# EAGLE schematic umod4 (EAGLE 7.6.0)

## Sheet 1 of 8
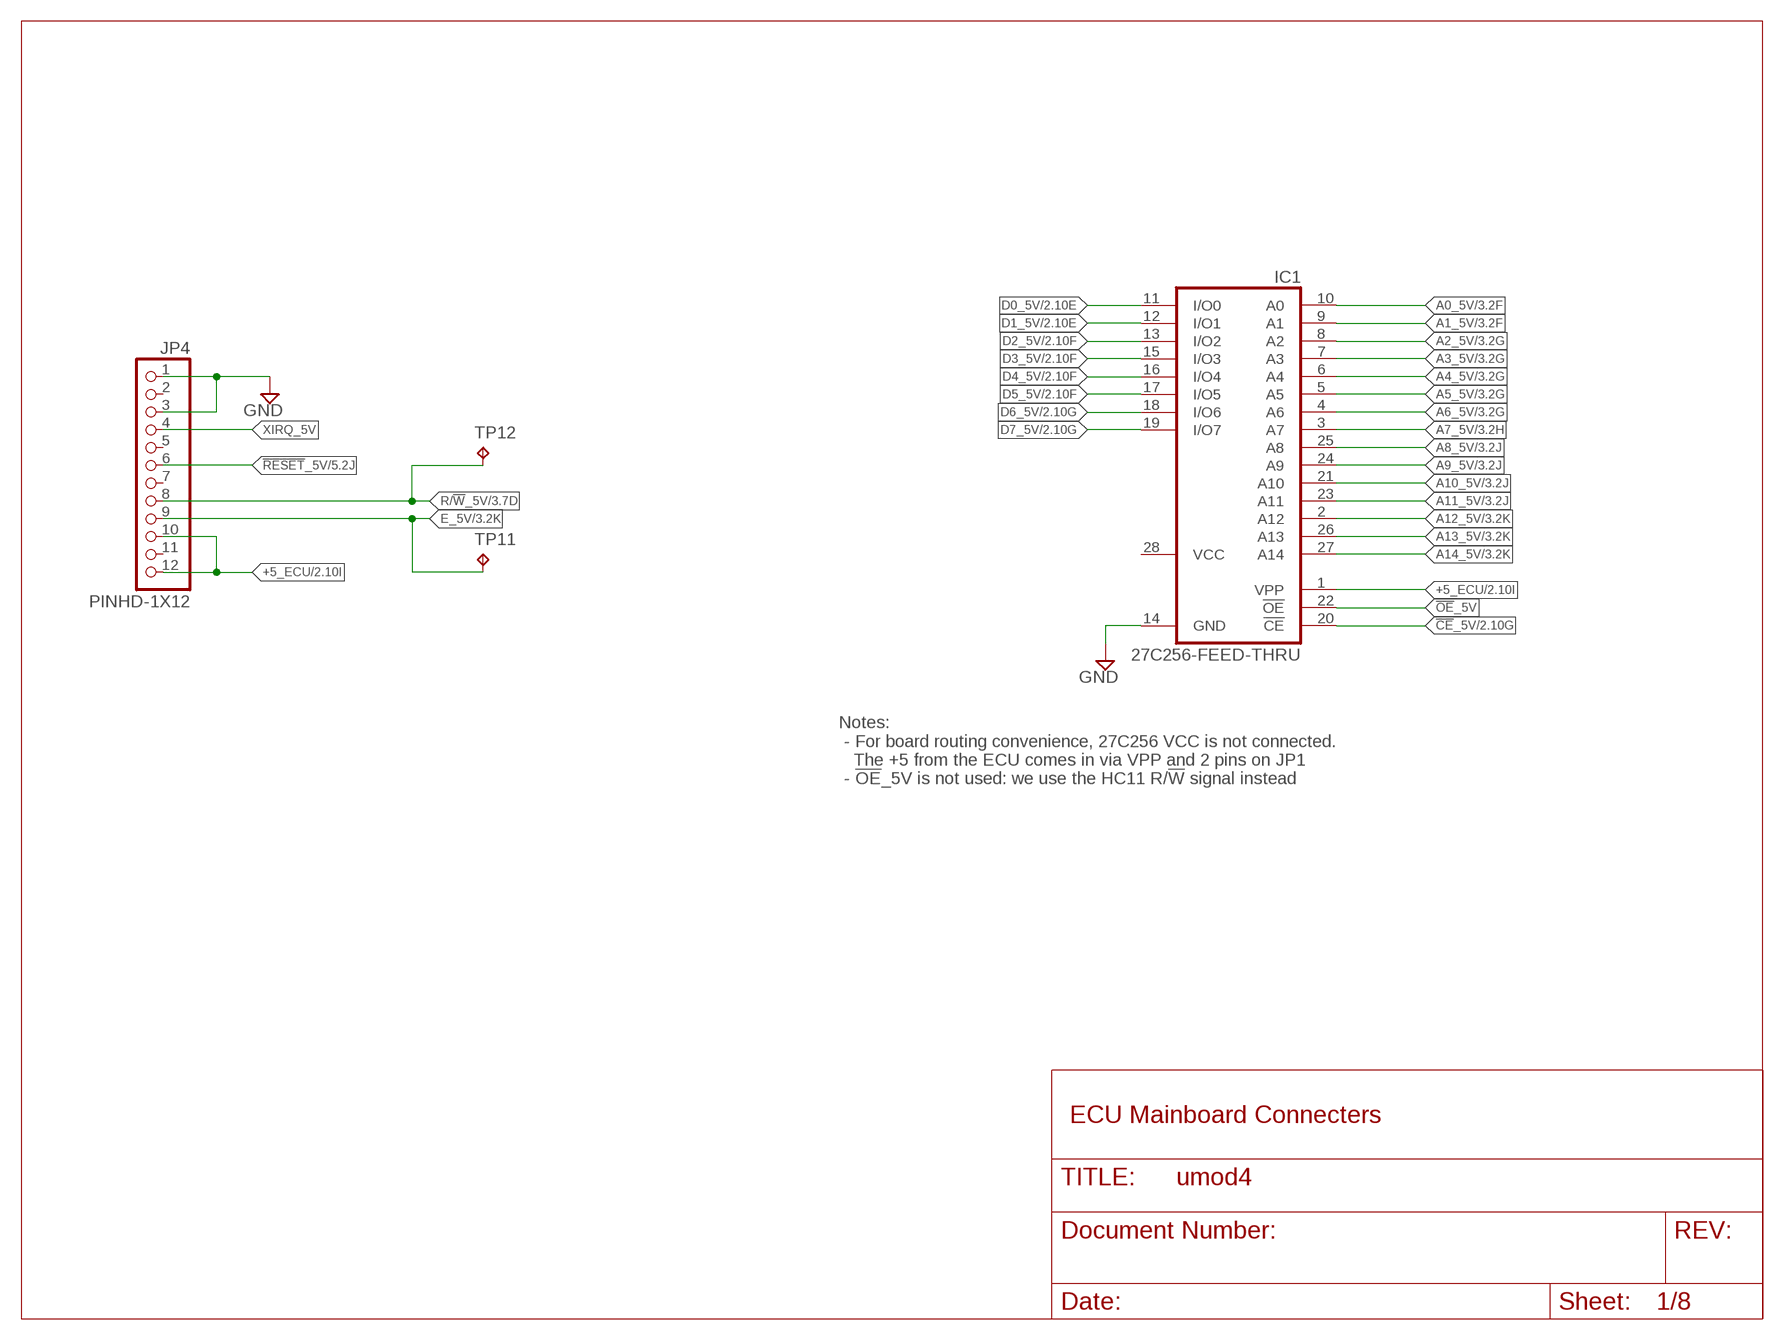
[diagram p0: schematic, sheet 1]

### Parts
IC1  27C256-FEED-THRU  27C256-FEED-THRUDIL28-6  [DIL28-6]
JP4  PINHD-1X12  [1X12]
TP11  1035  TEST-POINT-1035  [KEYSTONE-1035]
TP12  1035  TEST-POINT-1035  [KEYSTONE-1035]

### Nets
!CE!_5V: IC1.20(!CE) ; also sheet 2,3
!OE!_5V: IC1.22(!OE)
!RESET!_5V: JP4.6 ; also sheet 5
+5_ECU: IC1.1(VPP) JP4.10 JP4.12 ; also sheet 2,4
A0_5V: IC1.10(A0) ; also sheet 3
A1_5V: IC1.9(A1) ; also sheet 3
A2_5V: IC1.8(A2) ; also sheet 3
A3_5V: IC1.7(A3) ; also sheet 3
A4_5V: IC1.6(A4) ; also sheet 3
A5_5V: IC1.5(A5) ; also sheet 3
A6_5V: IC1.4(A6) ; also sheet 3
A7_5V: IC1.3(A7) ; also sheet 3
A8_5V: IC1.25(A8) ; also sheet 3
A9_5V: IC1.24(A9) ; also sheet 3
A10_5V: IC1.21(A10) ; also sheet 3
A11_5V: IC1.23(A11) ; also sheet 3
A12_5V: IC1.2(A12) ; also sheet 3
A13_5V: IC1.26(A13) ; also sheet 3
A14_5V: IC1.27(A14) ; also sheet 3
D0_5V: IC1.11(I/O0) ; also sheet 2
D1_5V: IC1.12(I/O1) ; also sheet 2
D2_5V: IC1.13(I/O2) ; also sheet 2
D3_5V: IC1.15(I/O3) ; also sheet 2
D4_5V: IC1.16(I/O4) ; also sheet 2
D5_5V: IC1.17(I/O5) ; also sheet 2
D6_5V: IC1.18(I/O6) ; also sheet 2
D7_5V: IC1.19(I/O7) ; also sheet 2
E_5V: JP4.9 TP11.P$1(TP) ; also sheet 3
GND: IC1.14(GND) JP4.1 JP4.3 ; also sheet 2,3,4,5,6,7,8
R/!W!_5V: JP4.8 TP12.P$1(TP) ; also sheet 3
XIRQ_5V: JP4.4
Unconnected: JP4.2 JP4.5 JP4.7 JP4.11

### Notes on the sheet
- Notes:
   - For board routing convenience, 27C256 VCC is not connected.
     The +5 from the ECU comes in via VPP and 2 pins on JP1
   - !OE!_5V is not used: we use the HC11 R/!W! signal instead
- ECU Mainboard Connecters

## Sheet 2 of 8
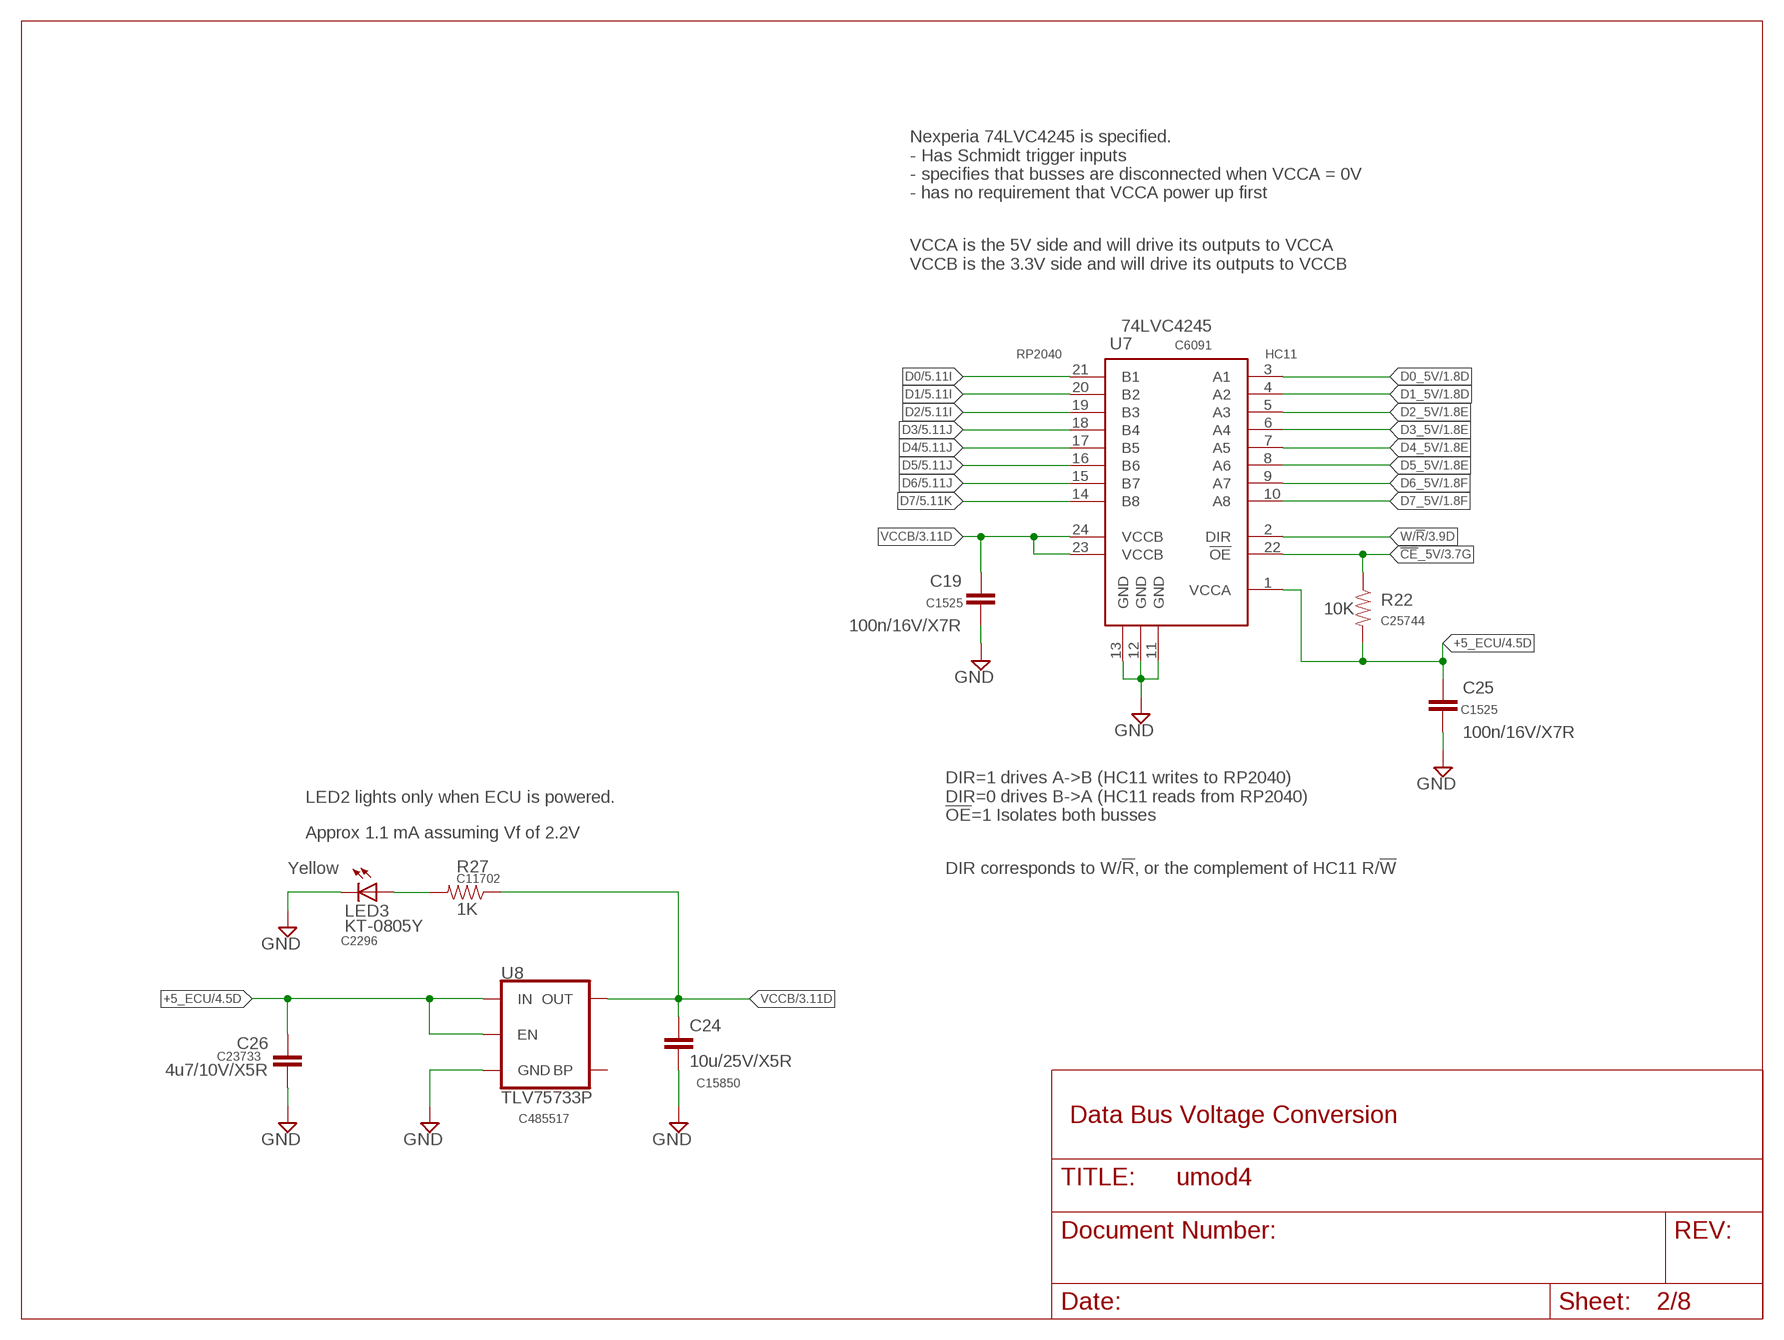
[diagram p1: schematic, sheet 2]

### Parts
C19  100n/16V/X7R  CAP0402-CAP  [0402-CAP]
C24  10u/25V/X5R  CAP-0805  [SMD-0805]
C25  100n/16V/X7R  CAP0402-CAP  [0402-CAP]
C26  4u7/10V/X5R  CAP0402-CAP  [0402-CAP]
LED3  KT-0805Y  LEDSML0805  [SML0805]
R22  10K  RESISTOR0402-RES  [0402-RES]
R27  1K  RESISTOR0402-RES  [0402-RES]
U7  74LVC4245  74LVC4245-TSSOP24  [TSSOP-24]
U8  TLV75733P  V_REG_MIC52053.3V  [SOT23-5]

### Nets
!CE!_5V: R22.1 U7.22(!OE) ; also sheet 1,3
+5_ECU: C25.1 C26.1 R22.2 U7.1(VCCA) U8.1(IN) U8.3(EN) ; also sheet 1,4
D0: U7.21(B1) ; also sheet 5
D0_5V: U7.3(A1) ; also sheet 1
D1: U7.20(B2) ; also sheet 5
D1_5V: U7.4(A2) ; also sheet 1
D2: U7.19(B3) ; also sheet 5
D2_5V: U7.5(A3) ; also sheet 1
D3: U7.18(B4) ; also sheet 5
D3_5V: U7.6(A4) ; also sheet 1
D4: U7.17(B5) ; also sheet 5
D4_5V: U7.7(A5) ; also sheet 1
D5: U7.16(B6) ; also sheet 5
D5_5V: U7.8(A6) ; also sheet 1
D6: U7.15(B7) ; also sheet 5
D6_5V: U7.9(A7) ; also sheet 1
D7: U7.14(B8) ; also sheet 5
D7_5V: U7.10(A8) ; also sheet 1
GND: C19.2 C24.2 C25.2 C26.2 LED3.C U7.11(GND) U7.12(GND) U7.13(GND) U8.2(GND) ; also sheet 1,3,4,5,6,7,8
N$3: LED3.A R27.2
VCCB: C19.1 C24.1 R27.1 U7.23(VCCB) U7.24(VCCB) U8.5(OUT) ; also sheet 3,6
W/!R!: U7.2(DIR) ; also sheet 3,5
Unconnected: U8.4(BP)

### Notes on the sheet
- Nexperia 74LVC4245 is specified.
  - Has Schmidt trigger inputs
  - specifies that busses are disconnected when VCCA = 0V
  - has no requirement that VCCA power up first
- VCCA is the 5V side and will drive its outputs to VCCA
  VCCB is the 3.3V side and will drive its outputs to VCCB
- RP2040 | HC11
- LED2 lights only when ECU is powered.
- DIR=1 drives A->B (HC11 writes to RP2040)
  DIR=0 drives B->A (HC11 reads from RP2040)
  !OE!=1 Isolates both busses
- Approx 1.1 mA assuming Vf of 2.2V
- Yellow | DIR corresponds to W/!R!, or the complement of HC11 R/!W!
- Data Bus Voltage Conversion

## Sheet 3 of 8
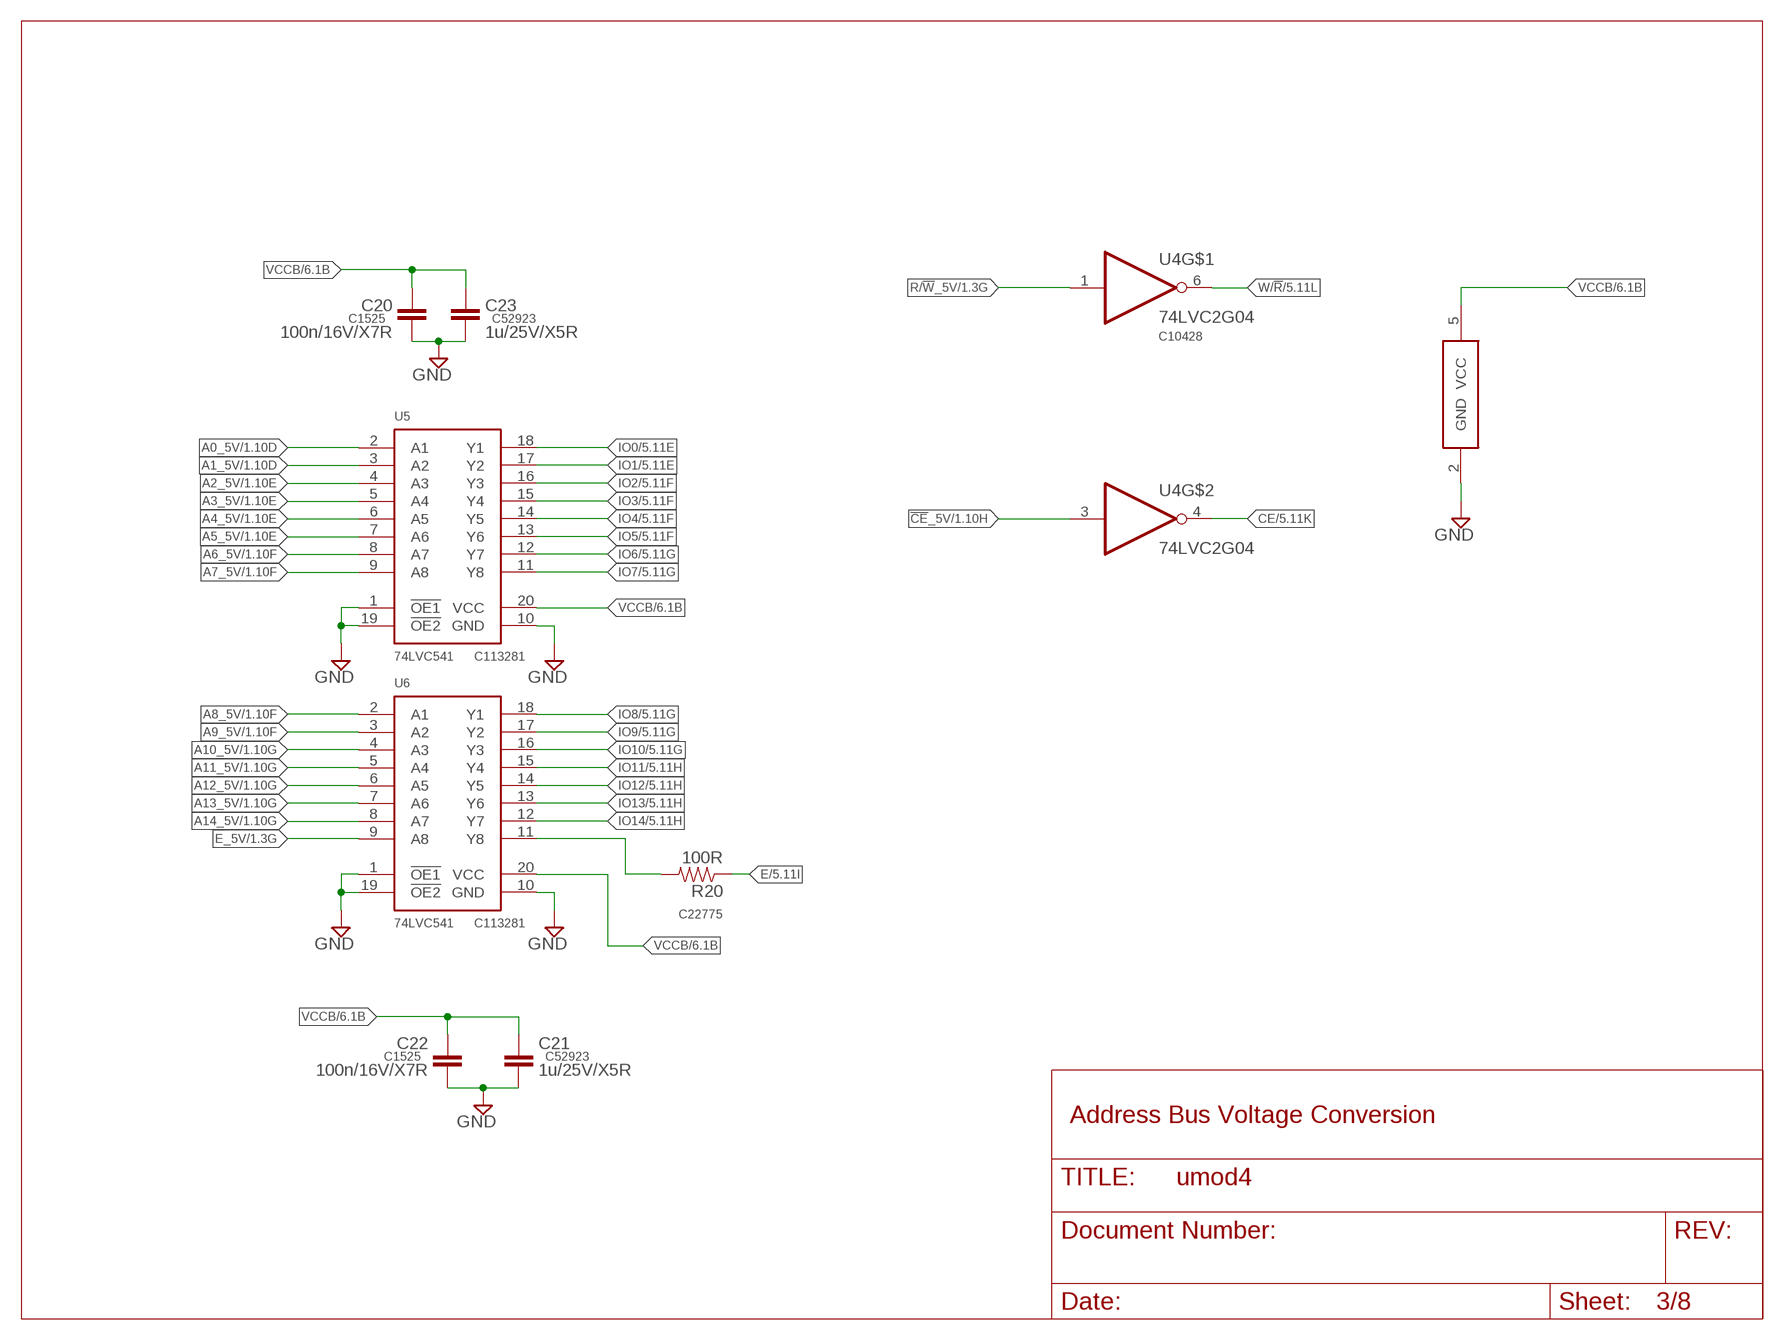
[diagram p2: schematic, sheet 3]

### Parts
C20  100n/16V/X7R  CAP0402-CAP  [0402-CAP]
C21  1u/25V/X5R  CAP0402-CAP  [0402-CAP]
C22  100n/16V/X7R  CAP0402-CAP  [0402-CAP]
C23  1u/25V/X5R  CAP0402-CAP  [0402-CAP]
R20  100R  RESISTOR0603-RES  [0603-RES]
U4  74LVC2G04  74LVC2G04-SOT23-6  [SOT23-6]
U5  74LVC541  74XX541-TSSOP20  [TSSOP-20]
U6  74LVC541  74XX541-TSSOP20  [TSSOP-20]

### Nets
!CE!_5V: U4.3(I) ; also sheet 1,2
A0_5V: U5.2(A1) ; also sheet 1
A1_5V: U5.3(A2) ; also sheet 1
A2_5V: U5.4(A3) ; also sheet 1
A3_5V: U5.5(A4) ; also sheet 1
A4_5V: U5.6(A5) ; also sheet 1
A5_5V: U5.7(A6) ; also sheet 1
A6_5V: U5.8(A7) ; also sheet 1
A7_5V: U5.9(A8) ; also sheet 1
A8_5V: U6.2(A1) ; also sheet 1
A9_5V: U6.3(A2) ; also sheet 1
A10_5V: U6.4(A3) ; also sheet 1
A11_5V: U6.5(A4) ; also sheet 1
A12_5V: U6.6(A5) ; also sheet 1
A13_5V: U6.7(A6) ; also sheet 1
A14_5V: U6.8(A7) ; also sheet 1
CE: U4.4(O) ; also sheet 5
E: R20.1 ; also sheet 5
E_5V: U6.9(A8) ; also sheet 1
GND: C20.2 C21.2 C22.2 C23.2 U4.2(GND) U5.1(!OE1) U5.10(GND) U5.19(!OE2) U6.1(!OE1) U6.10(GND) U6.19(!OE2) ; also sheet 1,2,4,5,6,7,8
IO0: U5.18(Y1) ; also sheet 5
IO1: U5.17(Y2) ; also sheet 5
IO2: U5.16(Y3) ; also sheet 5
IO3: U5.15(Y4) ; also sheet 5
IO4: U5.14(Y5) ; also sheet 5
IO5: U5.13(Y6) ; also sheet 5
IO6: U5.12(Y7) ; also sheet 5
IO7: U5.11(Y8) ; also sheet 5
IO8: U6.18(Y1) ; also sheet 5
IO9: U6.17(Y2) ; also sheet 5
IO10: U6.16(Y3) ; also sheet 5
IO11: U6.15(Y4) ; also sheet 5
IO12: U6.14(Y5) ; also sheet 5
IO13: U6.13(Y6) ; also sheet 5
IO14: U6.12(Y7) ; also sheet 5
N$20: R20.2 U6.11(Y8)
R/!W!_5V: U4.1(I) ; also sheet 1
VCCB: C20.1 C21.1 C22.1 C23.1 U4.5(VCC) U5.20(VCC) U6.20(VCC) ; also sheet 2,6
W/!R!: U4.6(O) ; also sheet 2,5

### Notes on the sheet
- Address Bus Voltage Conversion

## Sheet 4 of 8
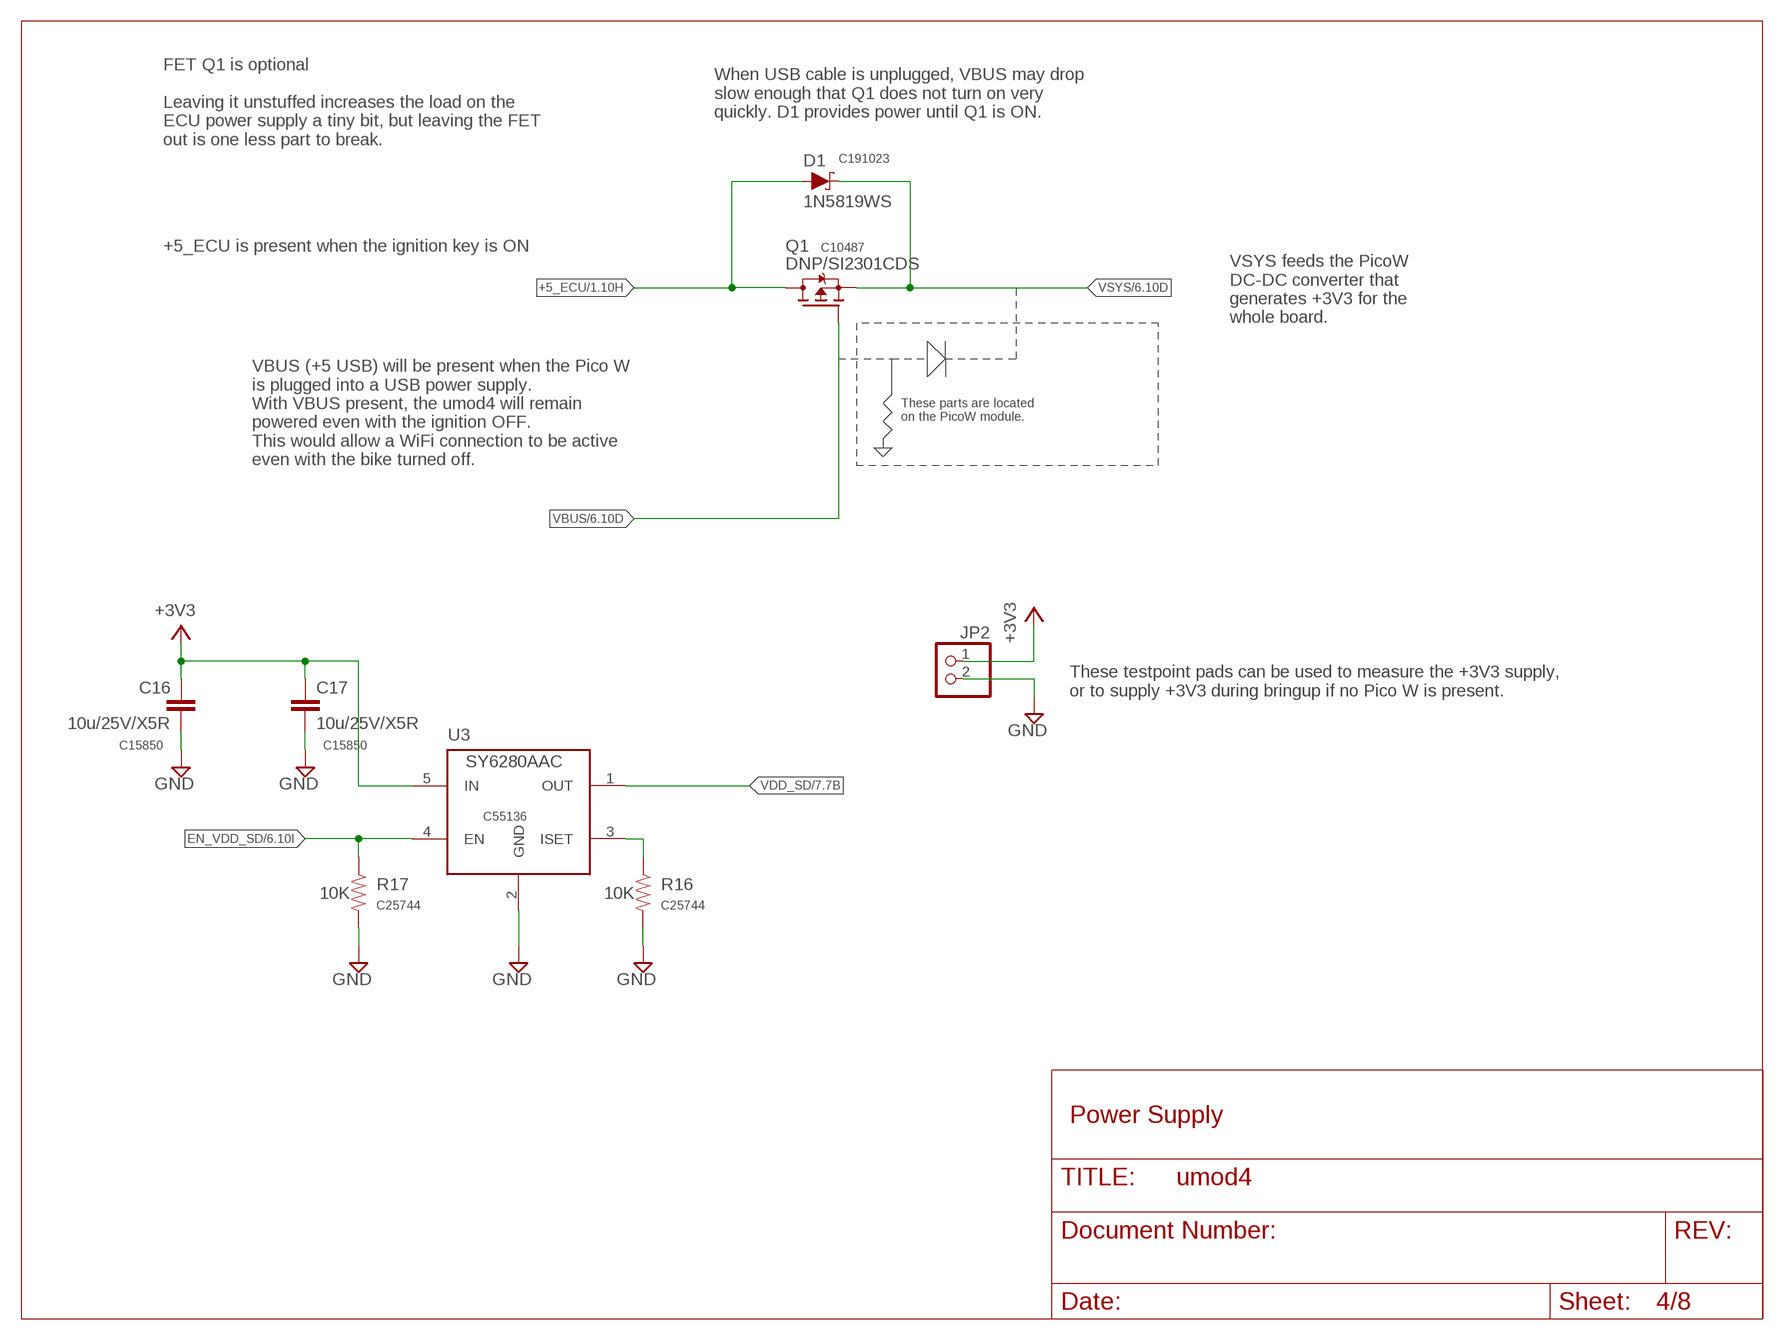
[diagram p3: schematic, sheet 4]

### Parts
C16  10u/25V/X5R  CAP-0805  [SMD-0805]
C17  10u/25V/X5R  CAP-0805  [SMD-0805]
D1  1N5819WS  DIODE-SCHOTTKY-BAT20J  [SOD-323]
JP2  PINHD-1X2  [1X02]
Q1  DNP/SI2301CDS  FET-P-CHANNELSI2369DS  [SOT23]
R16  10K  RESISTOR0402-RES  [0402-RES]
R17  10K  RESISTOR0402-RES  [0402-RES]
U3  SY6280AAC  HI-SIDE-SW  [SOT23-5]

### Nets
+3V3: C16.1 C17.1 JP2.1 U3.5(IN) ; also sheet 5,6,8
+5_ECU: D1.A Q1.D ; also sheet 1,2
EN_VDD_SD: R17.1 U3.4(EN) ; also sheet 6
GND: C16.2 C17.2 JP2.2 R16.2 R17.2 U3.2(GND) ; also sheet 1,2,3,5,6,7,8
N$14: R16.1 U3.3(ISET)
VBUS: Q1.G ; also sheet 6
VDD_SD: U3.1(OUT) ; also sheet 7
VSYS: D1.C Q1.S ; also sheet 6

### Notes on the sheet
- When USB cable is unplugged, VBUS may drop
  slow enough that Q1 does not turn on very 
  quickly. D1 provides power until Q1 is ON.
- FET Q1 is optional
  
  Leaving it unstuffed increases the load on the
  ECU power supply a tiny bit, but leaving the FET
  out is one less part to break.
- +5_ECU is present when the ignition key is ON
- VSYS feeds the PicoW
  DC-DC converter that
  generates +3V3 for the
  whole board.
- These parts are located
  on the PicoW module.
- VBUS (+5 USB) will be present when the Pico W
  is plugged into a USB power supply.
  With VBUS present, the umod4 will remain
  powered even with the ignition OFF.
  This would allow a WiFi connection to be active
  even with the bike turned off.
- These testpoint pads can be used to measure the +3V3 supply,
  or to supply +3V3 during bringup if no Pico W is present.
- Power Supply

## Sheet 5 of 8
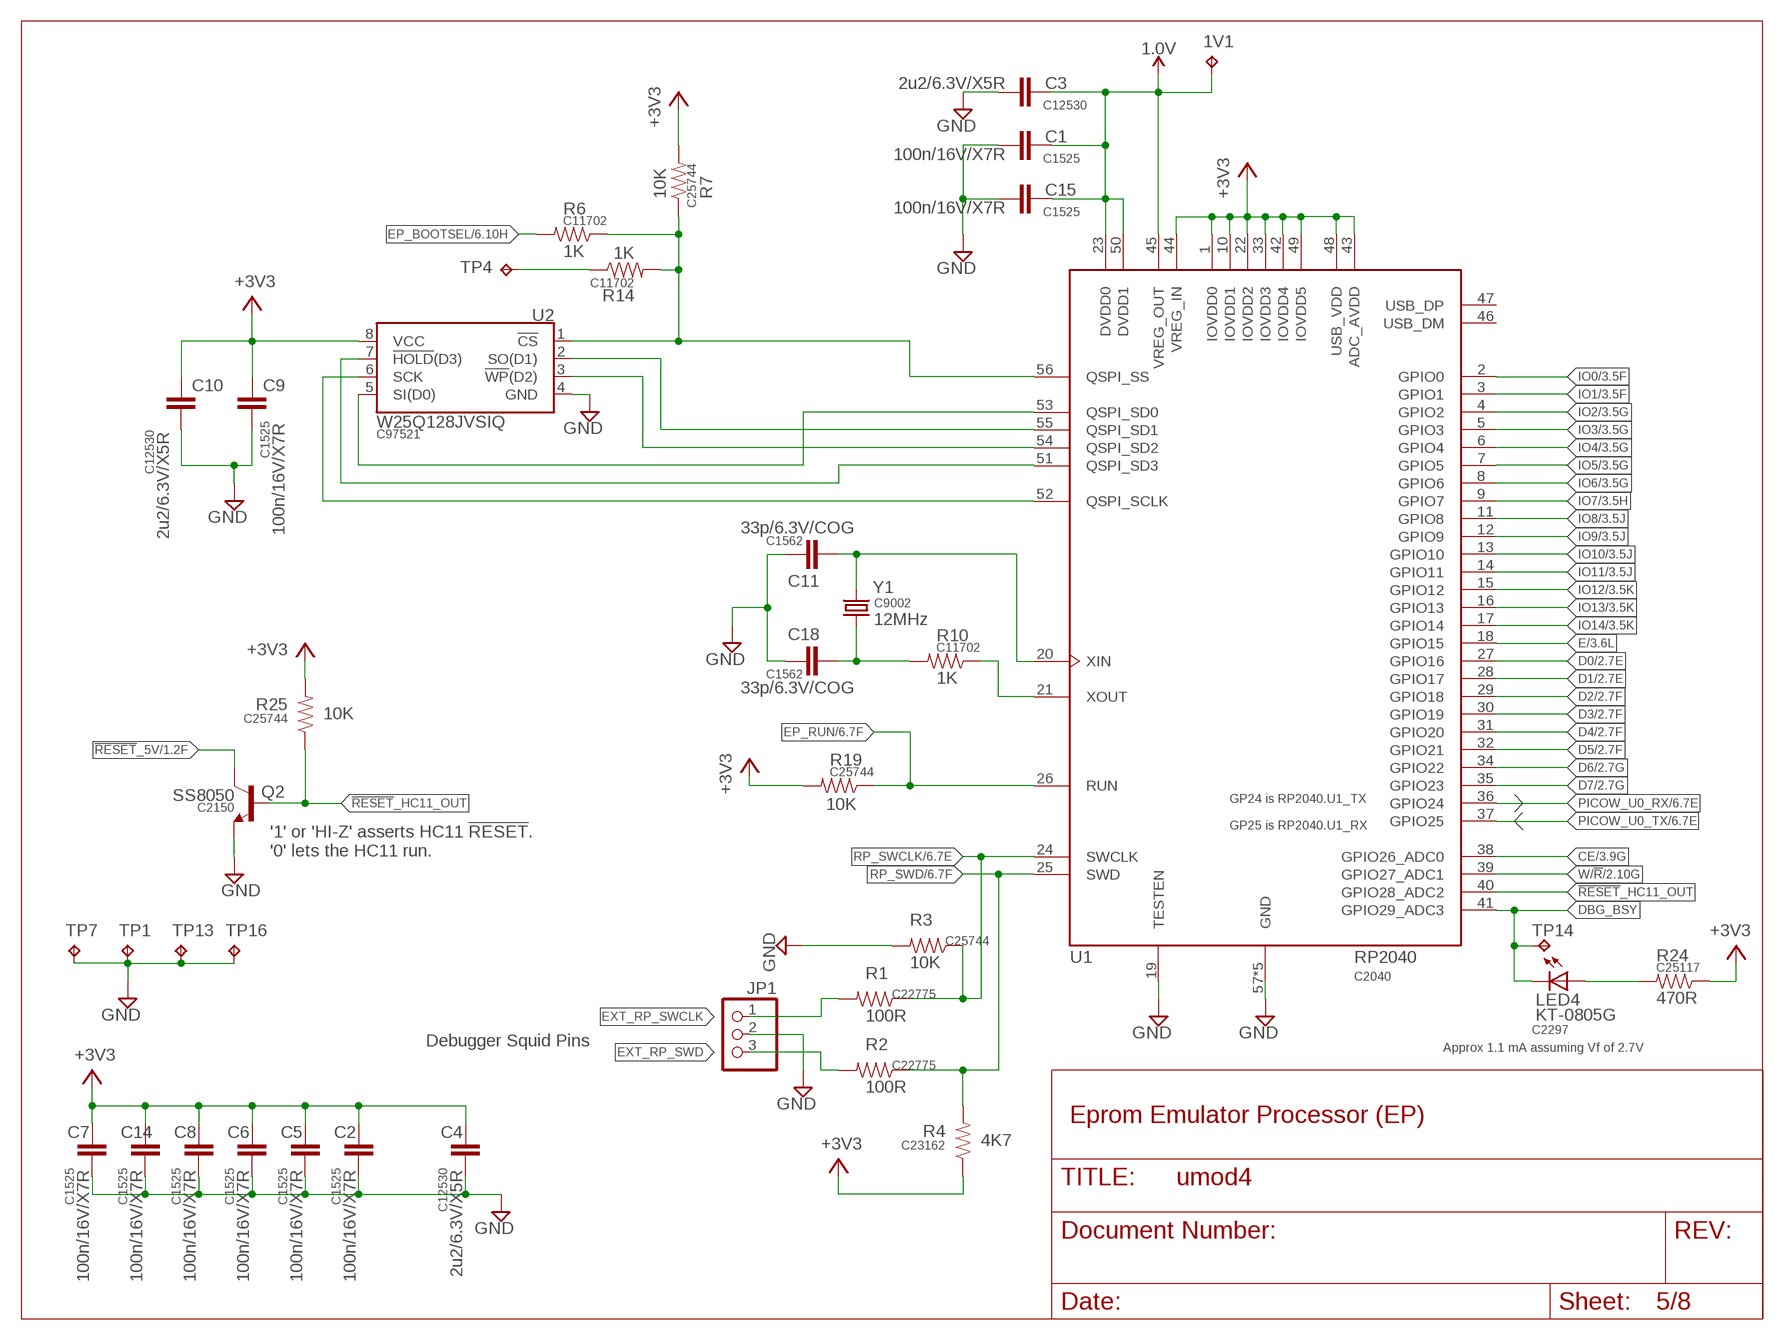
[diagram p4: schematic, sheet 5]

### Parts
1V1  TPB1,27  [B1,27]
C1  100n/16V/X7R  CAP0402-CAP  [0402-CAP]
C2  100n/16V/X7R  CAP0402-CAP  [0402-CAP]
C3  2u2/6.3V/X5R  CAP0402-CAP  [0402-CAP]
C4  2u2/6.3V/X5R  CAP0402-CAP  [0402-CAP]
C5  100n/16V/X7R  CAP0402-CAP  [0402-CAP]
C6  100n/16V/X7R  CAP0402-CAP  [0402-CAP]
C7  100n/16V/X7R  CAP0402-CAP  [0402-CAP]
C8  100n/16V/X7R  CAP0402-CAP  [0402-CAP]
C9  100n/16V/X7R  CAP0402-CAP  [0402-CAP]
C10  2u2/6.3V/X5R  CAP0402-CAP  [0402-CAP]
C11  33p/6.3V/COG  CAP0402-CAP  [0402-CAP]
C14  100n/16V/X7R  CAP0402-CAP  [0402-CAP]
C15  100n/16V/X7R  CAP0402-CAP  [0402-CAP]
C18  33p/6.3V/COG  CAP0402-CAP  [0402-CAP]
JP1  PINHD-1X3  [1X03]
LED4  KT-0805G  LEDSML0805  [SML0805]
Q2  SS8050  TRANS_NPN-MMBTA42  [SOT23-3]
R1  100R  RESISTOR0603-RES  [0603-RES]
R2  100R  RESISTOR0603-RES  [0603-RES]
R3  10K  RESISTOR0402-RES  [0402-RES]
R4  4K7  RESISTOR0603-RES  [0603-RES]
R6  1K  RESISTOR0402-RES  [0402-RES]
R7  10K  RESISTOR0402-RES  [0402-RES]
R10  1K  RESISTOR0402-RES  [0402-RES]
R14  1K  RESISTOR0402-RES  [0402-RES]
R19  10K  RESISTOR0402-RES  [0402-RES]
R24  470R  RESISTOR0402-RES  [0402-RES]
R25  10K  RESISTOR0402-RES  [0402-RES]
TP1  1035  TEST-POINT-1035  [KEYSTONE-1035]
TP4  1035  TEST-POINT-1035  [KEYSTONE-1035]
TP7  1035  TEST-POINT-1035  [KEYSTONE-1035]
TP13  1035  TEST-POINT-1035  [KEYSTONE-1035]
TP14  1035  TEST-POINT-1035  [KEYSTONE-1035]
TP16  1035  TEST-POINT-1035  [KEYSTONE-1035]
U1  RP2040  RP2040-QFN56  [RP2040-QFN56]
U2  W25Q128JVSIQ  W25Q32FVSS  [SOIC-8]
Y1  12MHz  CRYSTALSMD-3.2X2.5  [CRYSTAL-SMD-3.2X2.5MM]

### Nets
1.0V: 1V1.TP C1.1 C3.1 C15.1 U1.23(DVDD0) U1.45(VREG_OUT) U1.50(DVDD1)
!RESET!_5V: Q2.3(C) ; also sheet 1
!RESET!_HC11_OUT: Q2.1(B) R25.1 U1.40(GPIO28_ADC2)
+3V3: C2.1 C4.1 C5.1 C6.1 C7.1 C8.1 C9.1 C10.1 C14.1 R4.1 R7.2 R19.2 R24.1 R25.2 U1.1(IOVDD0) U1.10(IOVDD1) U1.22(IOVDD2) U1.33(IOVDD3) U1.42(IOVDD4) U1.43(ADC_AVDD) U1.44(VREG_IN) U1.48(USB_VDD) U1.49(IOVDD5) U2.8(VCC) ; also sheet 4,6,8
CE: U1.38(GPIO26_ADC0) ; also sheet 3
D0: U1.27(GPIO16) ; also sheet 2
D1: U1.28(GPIO17) ; also sheet 2
D2: U1.29(GPIO18) ; also sheet 2
D3: U1.30(GPIO19) ; also sheet 2
D4: U1.31(GPIO20) ; also sheet 2
D5: U1.32(GPIO21) ; also sheet 2
D6: U1.34(GPIO22) ; also sheet 2
D7: U1.35(GPIO23) ; also sheet 2
DBG_BSY: LED4.C TP14.P$1(TP) U1.41(GPIO29_ADC3)
E: U1.18(GPIO15) ; also sheet 3
EP_BOOTSEL: R6.2 ; also sheet 6
EP_RUN: R19.1 U1.26(RUN) ; also sheet 6
EXT_RP_SWCLK: JP1.1 R1.2
EXT_RP_SWD: JP1.3 R2.2
GND: C1.2 C2.2 C3.2 C4.2 C5.2 C6.2 C7.2 C8.2 C9.2 C10.2 C11.1 C14.2 C15.2 C18.1 JP1.2 Q2.2(E) R3.2 TP1.P$1(TP) TP7.P$1(TP) TP13.P$1(TP) TP16.P$1(TP) U1.19(TESTEN) U1.57(GND) U1.GND@1(GND) U1.GND@2(GND) U1.GND@3(GND) U1.GND@4(GND) U2.4(GND) ; also sheet 1,2,3,4,6,7,8
IO0: U1.2(GPIO0) ; also sheet 3
IO1: U1.3(GPIO1) ; also sheet 3
IO2: U1.4(GPIO2) ; also sheet 3
IO3: U1.5(GPIO3) ; also sheet 3
IO4: U1.6(GPIO4) ; also sheet 3
IO5: U1.7(GPIO5) ; also sheet 3
IO6: U1.8(GPIO6) ; also sheet 3
IO7: U1.9(GPIO7) ; also sheet 3
IO8: U1.11(GPIO8) ; also sheet 3
IO9: U1.12(GPIO9) ; also sheet 3
IO10: U1.13(GPIO10) ; also sheet 3
IO11: U1.14(GPIO11) ; also sheet 3
IO12: U1.15(GPIO12) ; also sheet 3
IO13: U1.16(GPIO13) ; also sheet 3
IO14: U1.17(GPIO14) ; also sheet 3
N$1: C18.2 R10.2 Y1.1
N$2: C11.2 U1.20(XIN) Y1.3
N$4: R14.1 TP4.P$1(TP)
N$5: R10.1 U1.21(XOUT)
N$6: LED4.A R24.2
N$7: R6.1 R7.1 R14.2 U1.56(QSPI_SS) U2.1(!CS!)
N$8: U1.52(QSPI_SCLK) U2.6(SCK)
N$9: U1.53(QSPI_SD0) U2.5(SI(D0))
N$10: U1.55(QSPI_SD1) U2.2(SO(D1))
N$11: U1.54(QSPI_SD2) U2.3(!WP!(D2))
N$12: U1.51(QSPI_SD3) U2.7(!HOLD!(D3))
PICOW_U0_RX: U1.36(GPIO24) ; also sheet 6
PICOW_U0_TX: U1.37(GPIO25) ; also sheet 6
RP_SWCLK: R1.1 R3.1 U1.24(SWCLK) ; also sheet 6
RP_SWD: R2.1 R4.2 U1.25(SWD) ; also sheet 6
W/!R!: U1.39(GPIO27_ADC1) ; also sheet 2,3
Unconnected: U1.46(USB_DM) U1.47(USB_DP)

### Notes on the sheet
- GP24 is RP2040.U1_TX
- GP25 is RP2040.U1_RX
- '1' or 'HI-Z' asserts HC11 !RESET!.
  '0' lets the HC11 run.
- Debugger Squid Pins
- Approx 1.1 mA assuming Vf of 2.7V
- Eprom Emulator Processor (EP)

## Sheet 6 of 8
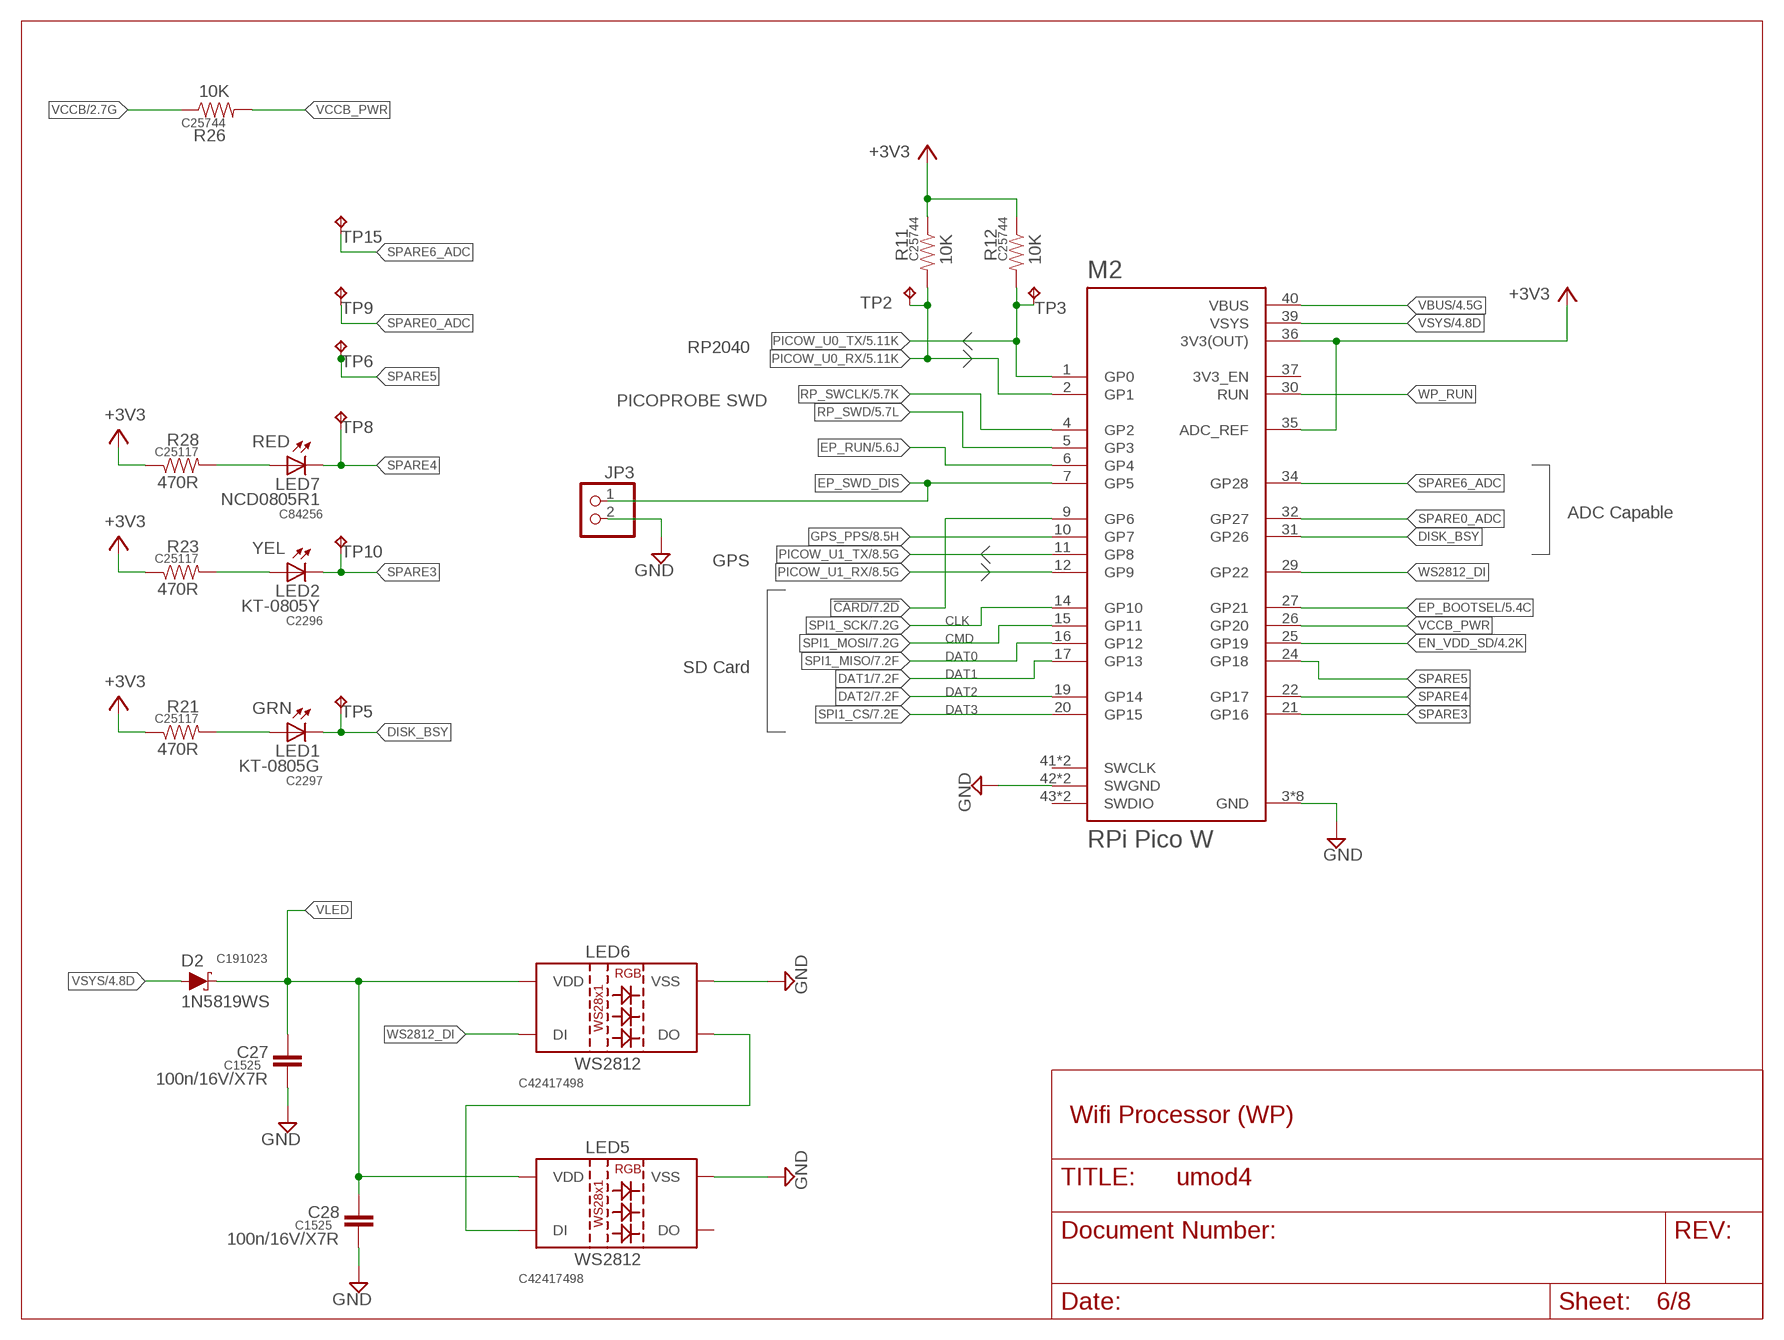
[diagram p5: schematic, sheet 6]

### Parts
C27  100n/16V/X7R  CAP0402-CAP  [0402-CAP]
C28  100n/16V/X7R  CAP0402-CAP  [0402-CAP]
D2  1N5819WS  DIODE-SCHOTTKY-BAT20J  [SOD-323]
JP3  PINHD-1X2  [1X02]
LED1  KT-0805G  LEDSML0805  [SML0805]
LED2  KT-0805Y  LEDSML0805  [SML0805]
LED5  WS2812  WS2812B  [WS2812B]
LED6  WS2812  WS2812B  [WS2812B]
LED7  NCD0805R1  LEDSML0805  [SML0805]
M2  RPi Pico W  PICO-OR-PICOW'-PICO-OR-W'  [PICO-TH]
R11  10K  RESISTOR0402-RES  [0402-RES]
R12  10K  RESISTOR0402-RES  [0402-RES]
R21  470R  RESISTOR0402-RES  [0402-RES]
R23  470R  RESISTOR0402-RES  [0402-RES]
R26  10K  RESISTOR0402-RES  [0402-RES]
R28  470R  RESISTOR0402-RES  [0402-RES]
TP2  1035  TEST-POINT-1035  [KEYSTONE-1035]
TP3  1035  TEST-POINT-1035  [KEYSTONE-1035]
TP5  1035  TEST-POINT-1035  [KEYSTONE-1035]
TP6  1035  TEST-POINT-1035  [KEYSTONE-1035]
TP8  1035  TEST-POINT-1035  [KEYSTONE-1035]
TP9  1035  TEST-POINT-1035  [KEYSTONE-1035]
TP10  1035  TEST-POINT-1035  [KEYSTONE-1035]
TP15  1035  TEST-POINT-1035  [KEYSTONE-1035]

### Nets
!CARD: M2.9(GP6) ; also sheet 7
+3V3: M2.35(ADC_REF) M2.36(3V3(OUT)) R11.1 R12.1 R21.1 R23.1 R28.1 ; also sheet 4,5,8
DAT1: M2.17(GP13) ; also sheet 7
DAT2: M2.19(GP14) ; also sheet 7
DISK_BSY: LED1.C M2.31(GP26) TP5.P$1(TP)
EN_VDD_SD: M2.25(GP19) ; also sheet 4
EP_BOOTSEL: M2.27(GP21) ; also sheet 5
EP_RUN: M2.6(GP4) ; also sheet 5
EP_SWD_DIS: JP3.1 M2.7(GP5)
GND: C27.2 C28.2 JP3.2 LED5.3(VSS) LED6.3(VSS) M2.3(GND) M2.8(GND) M2.13(GND) M2.18(GND) M2.23(GND) M2.28(GND) M2.33(GND) M2.38(GND) M2.42(SWGND) M2.45(SWGND) ; also sheet 1,2,3,4,5,7,8
GPS_PPS: M2.10(GP7) ; also sheet 8
N$13: LED2.A R23.2
N$19: LED5.4(DI) LED6.2(DO)
N$21: LED1.A R21.2
N$22: LED7.A R28.2
PICOW_U0_RX: M2.2(GP1) R11.2 TP2.P$1(TP) ; also sheet 5
PICOW_U0_TX: M2.1(GP0) R12.2 TP3.P$1(TP) ; also sheet 5
PICOW_U1_RX: M2.12(GP9) ; also sheet 8
PICOW_U1_TX: M2.11(GP8) ; also sheet 8
RP_SWCLK: M2.4(GP2) ; also sheet 5
RP_SWD: M2.5(GP3) ; also sheet 5
SPARE0_ADC: M2.32(GP27) TP9.P$1(TP)
SPARE3: LED2.C M2.21(GP16) TP10.P$1(TP)
SPARE4: LED7.C M2.22(GP17) TP8.P$1(TP)
SPARE5: M2.24(GP18) TP6.P$1(TP)
SPARE6_ADC: M2.34(GP28) TP15.P$1(TP)
SPI1_CS: M2.20(GP15) ; also sheet 7
SPI1_MISO: M2.16(GP12) ; also sheet 7
SPI1_MOSI: M2.15(GP11) ; also sheet 7
SPI1_SCK: M2.14(GP10) ; also sheet 7
VBUS: M2.40(VBUS) ; also sheet 4
VCCB: R26.1 ; also sheet 2,3
VCCB_PWR: M2.26(GP20) R26.2
VLED: C27.1 C28.1 D2.C LED5.1(VDD) LED6.1(VDD)
VSYS: D2.A M2.39(VSYS) ; also sheet 4
WP_RUN: M2.30(RUN)
WS2812_DI: LED6.4(DI) M2.29(GP22)
Unconnected: LED5.2(DO) M2.37(3V3_EN) M2.41(SWCLK) M2.43(SWDIO) M2.44(SWCLK) M2.46(SWDIO)

### Notes on the sheet
- RP2040
- PICOPROBE SWD
- RED
- ADC Capable
- YEL | GPS
- CLK
- CMD
- SD Card | DAT0
- DAT1
- DAT2
- GRN | DAT3
- Wifi Processor (WP)

## Sheet 7 of 8
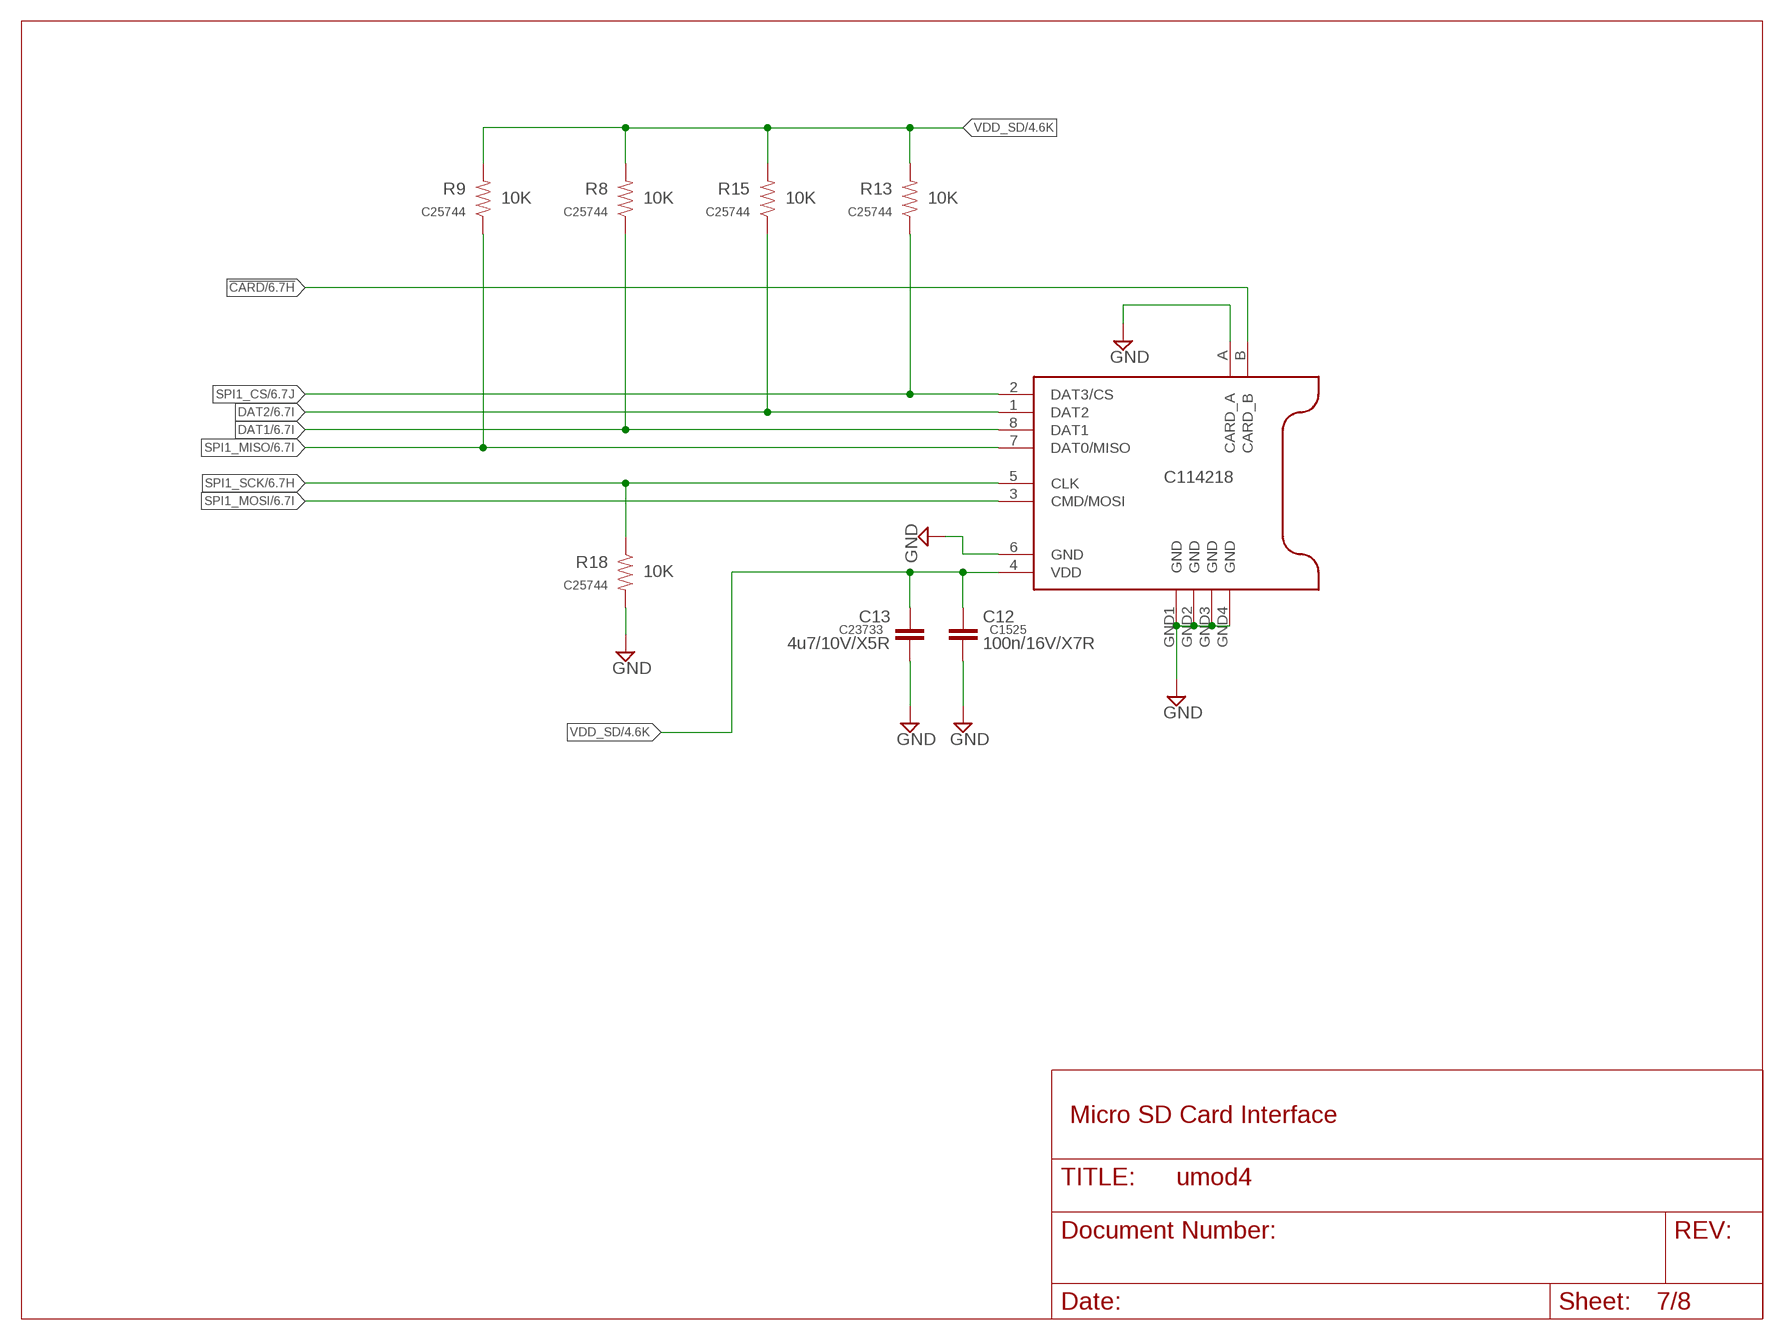
[diagram p6: schematic, sheet 7]

### Parts
C12  100n/16V/X7R  CAP0402-CAP  [0402-CAP]
C13  4u7/10V/X5R  CAP0402-CAP  [0402-CAP]
R8  10K  RESISTOR0402-RES  [0402-RES]
R9  10K  RESISTOR0402-RES  [0402-RES]
R13  10K  RESISTOR0402-RES  [0402-RES]
R15  10K  RESISTOR0402-RES  [0402-RES]
R18  10K  RESISTOR0402-RES  [0402-RES]
SD1  DM3AT-SF-PEJM5  DM3AT-SF-PEJ  [DM3AT]

### Nets
!CARD: SD1.B(CARD_B) ; also sheet 6
DAT1: R8.1 SD1.8(DAT1) ; also sheet 6
DAT2: R15.1 SD1.1(DAT2) ; also sheet 6
GND: C12.2 C13.2 R18.2 SD1.6(GND) SD1.A(CARD_A) SD1.GND1(GND) SD1.GND2(GND) SD1.GND3(GND) SD1.GND4(GND) ; also sheet 1,2,3,4,5,6,8
SPI1_CS: R13.1 SD1.2(DAT3/CS) ; also sheet 6
SPI1_MISO: R9.1 SD1.7(DAT0/MISO) ; also sheet 6
SPI1_MOSI: SD1.3(CMD/MOSI) ; also sheet 6
SPI1_SCK: R18.1 SD1.5(CLK) ; also sheet 6
VDD_SD: C12.1 C13.1 R8.2 R9.2 R13.2 R15.2 SD1.4(VDD) ; also sheet 4

### Notes on the sheet
- Micro SD Card Interface

## Sheet 8 of 8
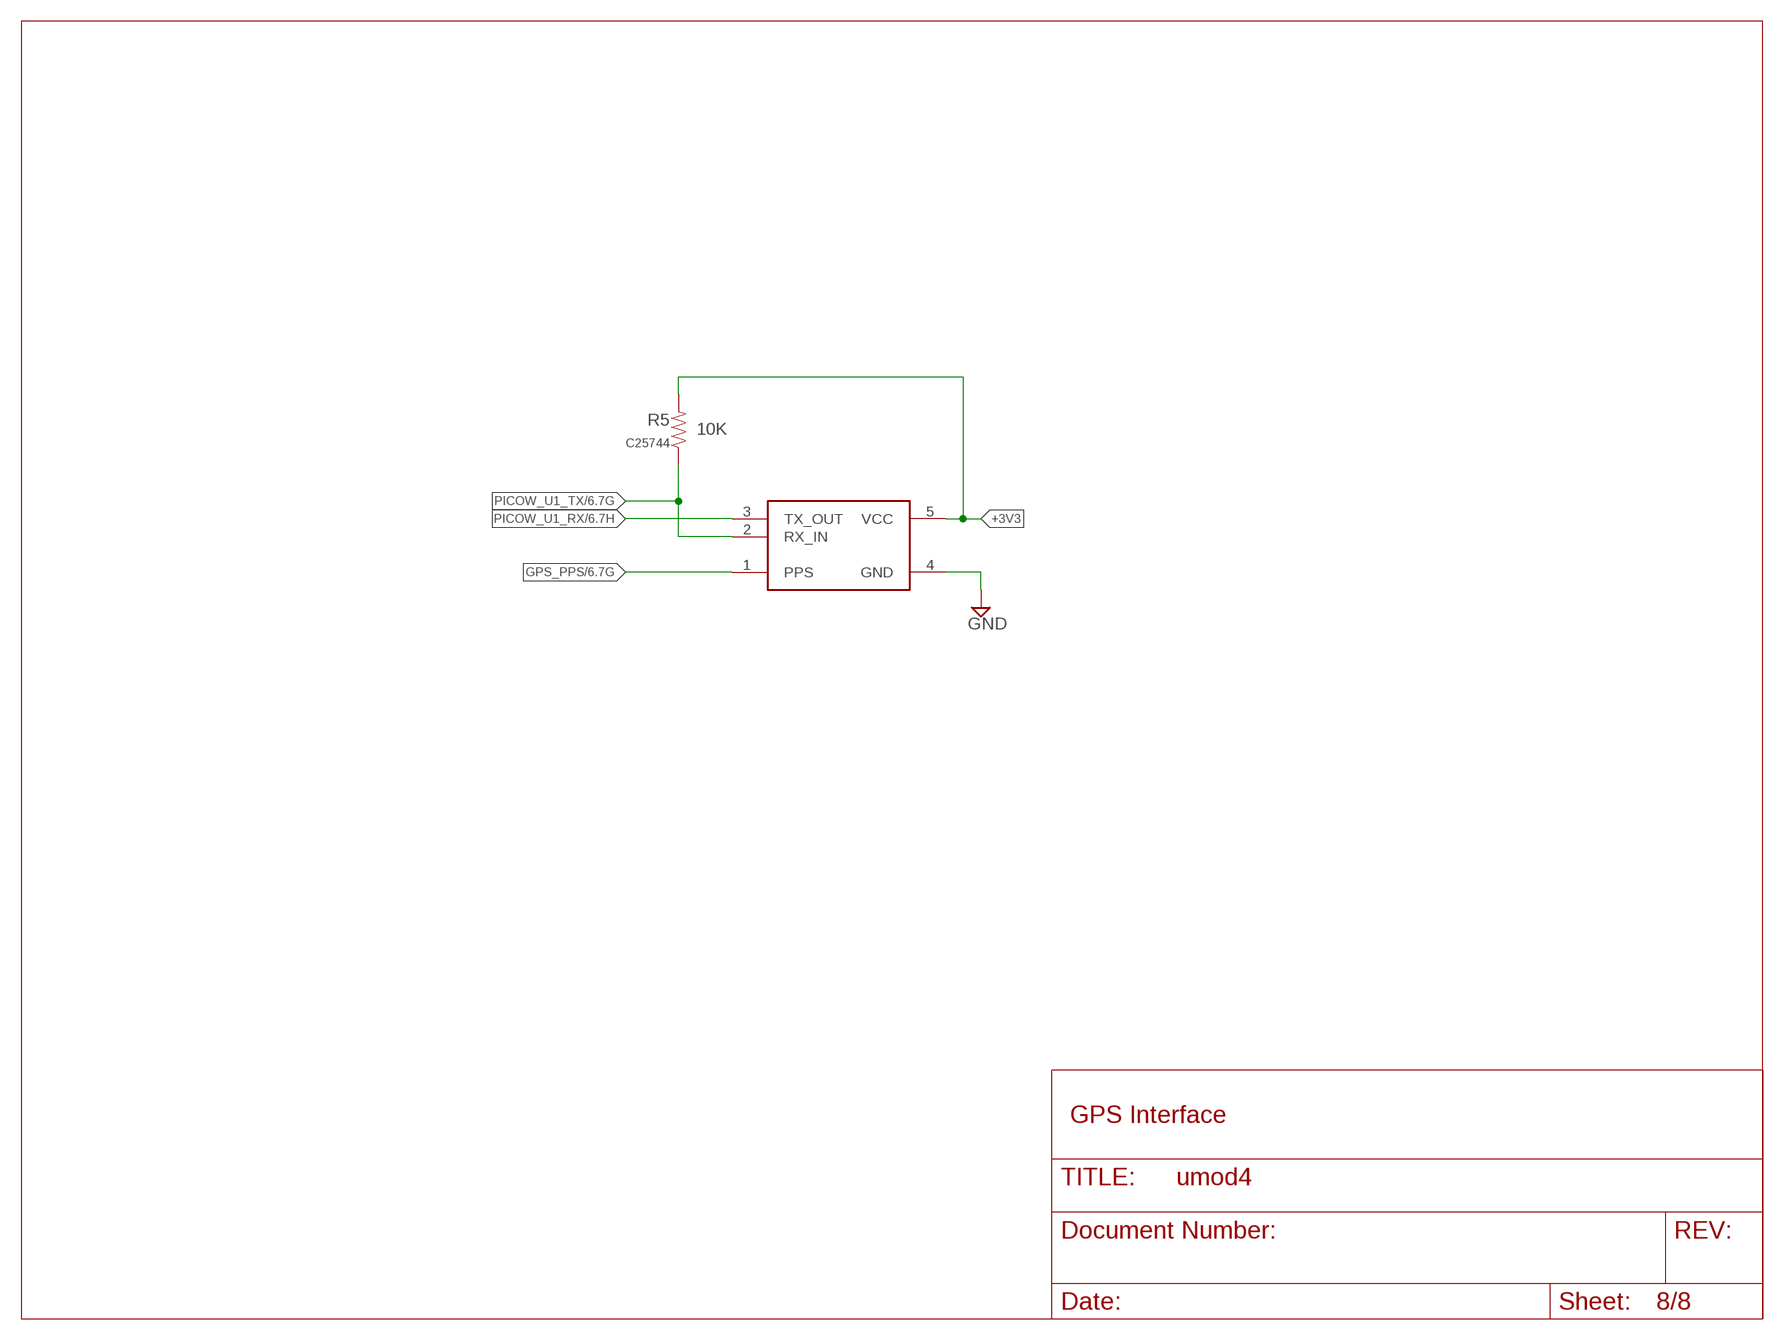
[diagram p7: schematic, sheet 8]

### Parts
M1  Generic single-sided NEO-8  GPS-GENERIC-DS-DBL-SIDED  [GPS-MODULE-DS]
R5  10K  RESISTOR0402-RES  [0402-RES]

### Nets
+3V3: M1.5(VCC) R5.2 ; also sheet 4,5,6
GND: M1.4(GND) ; also sheet 1,2,3,4,5,6,7
GPS_PPS: M1.1(PPS) ; also sheet 6
PICOW_U1_RX: M1.3(TX_OUT) ; also sheet 6
PICOW_U1_TX: M1.2(RX_IN) R5.1 ; also sheet 6

### Notes on the sheet
- GPS Interface

## Power pins joined to a net without a drawn wire
VCC: IC1.28(VCC)

## Library data of the parts
1V1 = testpad:TP: Test pad
C1 C2 C5-C9 C12 C14 C15 C19 C20 C22 C25 C27 C28 = SparkFun-03-01-2010:CAP: Capacitor Standard 0603 ceramic capacitor, and 0.1" leaded capacitor.; LCSC_PART: C1525
C3 C4 C10 = SparkFun-03-01-2010:CAP: Capacitor Standard 0603 ceramic capacitor, and 0.1" leaded capacitor.; LCSC_PART: C12530
C11 C18 = SparkFun-03-01-2010:CAP: Capacitor Standard 0603 ceramic capacitor, and 0.1" leaded capacitor.; LCSC_PART: C1562
C13 C26 = SparkFun-03-01-2010:CAP: Capacitor Standard 0603 ceramic capacitor, and 0.1" leaded capacitor.; LCSC_PART: C23733
C16 C17 C24 = robins-v7:CAP: Generic Capacitor in various packages; LCSC_PART: C15850
C21 C23 = SparkFun-03-01-2010:CAP: Capacitor Standard 0603 ceramic capacitor, and 0.1" leaded capacitor.; LCSC_PART: C52923
D1 D2 = SparkFun-DiscreteSemi:DIODE-SCHOTTKY: Schottky diode A Schottky diode is a semiconductor diode which has a low forward voltage drop and a very fast switching action.; LCSC_PART: C191023; PROD_ID: DIO-11623; VALUE: 1A/23V/620mV
IC1 = robins:27C256-FEED-THRU
JP1 = pinhead:PINHD-1X3: PIN HEADER
JP2 JP3 = pinhead:PINHD-1X2: PIN HEADER
JP4 = robins:PINHD-1X12
LED1 LED4 = led:LED: LED OSRAM: - CHIPLED LG R971, LG N971, LY N971, LG Q971, LY Q971, LO R971, LY R971 LH N974, LH R974 LS Q976, LO Q976, LY Q976 LO Q996 - Hyper CHIPLED LW Q18S LB Q993, LB Q99A, LB R99A - SideLED LS A670, LO A670, LY A670, LG A670, LP A670 LB A673, LV A673, LT A673, LW A673 LH A674 LY A675 LS A676, LA A676, LO A676, LY A676, LW A676 LS A679, LY A679, LG A679 - Hyper Micro SIDELED® LS Y876, LA Y876, LO Y876, LY Y876 LT Y87S - SmartLED LW L88C, LW L88S LB L89C, LB L89S, LG L890 LS L89K, LO L89K, LY L89K LS L896, LA L896, LO L896, LY L896 - TOPLED LS T670, LO T670, LY T670, LG T670, LP T670 LSG T670, LSP T670, LSY T670, LOP T670, LYG T670 LG T671, LOG T671, LSG T671 LB T673, LV T673, LT T673, LW T673 LH T674 LS T676, LA T676, LO T676, LY T676, LB T676, LH T676, LSB T676, LW T676 LB T67C, LV T67C, LT T67C, LS T67K, LO T67K, LY T67K, LW E67C LS E67B, LA E67B, LO E67B, LY E67B, LB E67C, LV E67C, LT E67C LW T67C LS T679, LY T679, LG T679 LS T770, LO T770, LY T770, LG T770, LP T770 LB T773, LV T773, LT T773, LW T773 LH T774 LS E675, LA E675, LY E675, LS T675 LS T776, LA T776, LO T776, LY T776, LB T776 LHGB T686 LT T68C, LB T68C - Hyper Mini TOPLED® LB M676 - Mini TOPLED Santana® LG M470 LS M47K, LO M47K, LY M47K Source: http://www.osram.convergy.de LUXEON: - LUMILED® LXK2-PW12-R00, LXK2-PW12-S00, LXK2-PW14-U00, LXK2-PW14-V00 LXK2-PM12-R00, LXK2-PM12-S00, LXK2-PM14-U00 LXK2-PE12-Q00, LXK2-PE12-R00, LXK2-PE12-S00, LXK2-PE14-T00, LXK2-PE14-U00 LXK2-PB12-K00, LXK2-PB12-L00, LXK2-PB12-M00, LXK2-PB14-N00, LXK2-PB14-P00, LXK2-PB14-Q00 LXK2-PR12-L00, LXK2-PR12-M00, LXK2-PR14-Q00, LXK2-PR14-R00 LXK2-PD12-Q00, LXK2-PD12-R00, LXK2-PD12-S00 LXK2-PH12-R00, LXK2-PH12-S00 LXK2-PL12-P00, LXK2-PL12-Q00, LXK2-PL12-R00 Source: www.luxeon.com KINGBRIGHT: KA-3528ASYC Source: www.kingbright.com; LCSC_PART: C2297
LED2 LED3 = led:LED: LED OSRAM: - CHIPLED LG R971, LG N971, LY N971, LG Q971, LY Q971, LO R971, LY R971 LH N974, LH R974 LS Q976, LO Q976, LY Q976 LO Q996 - Hyper CHIPLED LW Q18S LB Q993, LB Q99A, LB R99A - SideLED LS A670, LO A670, LY A670, LG A670, LP A670 LB A673, LV A673, LT A673, LW A673 LH A674 LY A675 LS A676, LA A676, LO A676, LY A676, LW A676 LS A679, LY A679, LG A679 - Hyper Micro SIDELED® LS Y876, LA Y876, LO Y876, LY Y876 LT Y87S - SmartLED LW L88C, LW L88S LB L89C, LB L89S, LG L890 LS L89K, LO L89K, LY L89K LS L896, LA L896, LO L896, LY L896 - TOPLED LS T670, LO T670, LY T670, LG T670, LP T670 LSG T670, LSP T670, LSY T670, LOP T670, LYG T670 LG T671, LOG T671, LSG T671 LB T673, LV T673, LT T673, LW T673 LH T674 LS T676, LA T676, LO T676, LY T676, LB T676, LH T676, LSB T676, LW T676 LB T67C, LV T67C, LT T67C, LS T67K, LO T67K, LY T67K, LW E67C LS E67B, LA E67B, LO E67B, LY E67B, LB E67C, LV E67C, LT E67C LW T67C LS T679, LY T679, LG T679 LS T770, LO T770, LY T770, LG T770, LP T770 LB T773, LV T773, LT T773, LW T773 LH T774 LS E675, LA E675, LY E675, LS T675 LS T776, LA T776, LO T776, LY T776, LB T776 LHGB T686 LT T68C, LB T68C - Hyper Mini TOPLED® LB M676 - Mini TOPLED Santana® LG M470 LS M47K, LO M47K, LY M47K Source: http://www.osram.convergy.de LUXEON: - LUMILED® LXK2-PW12-R00, LXK2-PW12-S00, LXK2-PW14-U00, LXK2-PW14-V00 LXK2-PM12-R00, LXK2-PM12-S00, LXK2-PM14-U00 LXK2-PE12-Q00, LXK2-PE12-R00, LXK2-PE12-S00, LXK2-PE14-T00, LXK2-PE14-U00 LXK2-PB12-K00, LXK2-PB12-L00, LXK2-PB12-M00, LXK2-PB14-N00, LXK2-PB14-P00, LXK2-PB14-Q00 LXK2-PR12-L00, LXK2-PR12-M00, LXK2-PR14-Q00, LXK2-PR14-R00 LXK2-PD12-Q00, LXK2-PD12-R00, LXK2-PD12-S00 LXK2-PH12-R00, LXK2-PH12-S00 LXK2-PL12-P00, LXK2-PL12-Q00, LXK2-PL12-R00 Source: www.luxeon.com KINGBRIGHT: KA-3528ASYC Source: www.kingbright.com; LCSC_PART: C2296
LED5 LED6 = SparkFun-LED:WS2812B: WS2812B SMD addressable RGB LED 5x5mm SMD LED with built-in controller IC. Color: Red/Green/Blue mC Rating: RGB: 390, 660, 180 mcd Forward Voltage: RGB: 2.0, 3.0, 3.0 V Packages:WS2812B SparkFun Products: Blynk Board - ESP8266 <https://www.sparkfun.com/products/13794>; LCSC_PART: C42417498; PROD_ID: DIO-12503; VALUE: WS2812B
LED7 = led:LED: LED OSRAM: - CHIPLED LG R971, LG N971, LY N971, LG Q971, LY Q971, LO R971, LY R971 LH N974, LH R974 LS Q976, LO Q976, LY Q976 LO Q996 - Hyper CHIPLED LW Q18S LB Q993, LB Q99A, LB R99A - SideLED LS A670, LO A670, LY A670, LG A670, LP A670 LB A673, LV A673, LT A673, LW A673 LH A674 LY A675 LS A676, LA A676, LO A676, LY A676, LW A676 LS A679, LY A679, LG A679 - Hyper Micro SIDELED® LS Y876, LA Y876, LO Y876, LY Y876 LT Y87S - SmartLED LW L88C, LW L88S LB L89C, LB L89S, LG L890 LS L89K, LO L89K, LY L89K LS L896, LA L896, LO L896, LY L896 - TOPLED LS T670, LO T670, LY T670, LG T670, LP T670 LSG T670, LSP T670, LSY T670, LOP T670, LYG T670 LG T671, LOG T671, LSG T671 LB T673, LV T673, LT T673, LW T673 LH T674 LS T676, LA T676, LO T676, LY T676, LB T676, LH T676, LSB T676, LW T676 LB T67C, LV T67C, LT T67C, LS T67K, LO T67K, LY T67K, LW E67C LS E67B, LA E67B, LO E67B, LY E67B, LB E67C, LV E67C, LT E67C LW T67C LS T679, LY T679, LG T679 LS T770, LO T770, LY T770, LG T770, LP T770 LB T773, LV T773, LT T773, LW T773 LH T774 LS E675, LA E675, LY E675, LS T675 LS T776, LA T776, LO T776, LY T776, LB T776 LHGB T686 LT T68C, LB T68C - Hyper Mini TOPLED® LB M676 - Mini TOPLED Santana® LG M470 LS M47K, LO M47K, LY M47K Source: http://www.osram.convergy.de LUXEON: - LUMILED® LXK2-PW12-R00, LXK2-PW12-S00, LXK2-PW14-U00, LXK2-PW14-V00 LXK2-PM12-R00, LXK2-PM12-S00, LXK2-PM14-U00 LXK2-PE12-Q00, LXK2-PE12-R00, LXK2-PE12-S00, LXK2-PE14-T00, LXK2-PE14-U00 LXK2-PB12-K00, LXK2-PB12-L00, LXK2-PB12-M00, LXK2-PB14-N00, LXK2-PB14-P00, LXK2-PB14-Q00 LXK2-PR12-L00, LXK2-PR12-M00, LXK2-PR14-Q00, LXK2-PR14-R00 LXK2-PD12-Q00, LXK2-PD12-R00, LXK2-PD12-S00 LXK2-PH12-R00, LXK2-PH12-S00 LXK2-PL12-P00, LXK2-PL12-Q00, LXK2-PL12-R00 Source: www.luxeon.com KINGBRIGHT: KA-3528ASYC Source: www.kingbright.com; LCSC_PART: C84256
M1 = robins-v7:GPS-GENERIC-DS: Generic GPS modiule
M2 = robins-v7:PICO-OR-PICOW: This device can be stuffed as either a Pico or a Pico W.
Q1 = robins-v7:FET-P-CHANNEL: Generic P-channel FET; DNP_LCSC_PART: C10487
Q2 = SparkFun-DiscreteSemi:TRANS_NPN: NPN transistor Current controlled devices typically used to amplify current or used as a switch. BC547 - COM-08928 <http://www.sparkfun.com/products/8928> (TO-92 45V 100mA) (1.Collector 2.Base 3.Emitter) 2N3904 - COM-00521 <http://www.sparkfun.com/products/521> (TO-92 40V 200mA) (1.Emitter 2.Base 3.Collector) P2N2222A - COM-12852 <http://www.sparkfun.com/products/12852> (TO-92 40V 600mA) (1.Collector 2.Base 3.Emitter); LCSC_PART: C2150; PROD_ID: TRANS-09116; VALUE: 500mA/300V
R1 R2 R20 = SparkFun-03-01-2010:RESISTOR: Resistor Basic schematic elements and footprints for 0603, 1206, and PTH 1/10th watt (small) resistors.; LCSC_PART: C22775
R3 R5 R7-R9 R11-R13 R15-R19 R22 R25 R26 = SparkFun-03-01-2010:RESISTOR: Resistor Basic schematic elements and footprints for 0603, 1206, and PTH 1/10th watt (small) resistors.; LCSC_PART: C25744
R4 = SparkFun-03-01-2010:RESISTOR: Resistor Basic schematic elements and footprints for 0603, 1206, and PTH 1/10th watt (small) resistors.; LCSC_PART: C23162
R6 R10 R14 R27 = SparkFun-03-01-2010:RESISTOR: Resistor Basic schematic elements and footprints for 0603, 1206, and PTH 1/10th watt (small) resistors.; LCSC_PART: C11702
R21 R23 R24 R28 = SparkFun-03-01-2010:RESISTOR: Resistor Basic schematic elements and footprints for 0603, 1206, and PTH 1/10th watt (small) resistors.; LCSC_PART: C25117
SD1 = robins-v7:DM3AT-SF-PEJ: Micro SD Push-Push; LCSC_PART: C114218
TP1-TP16 = robins-v7:TEST-POINT: Through-hole test points in a couple different sizes.
U1 = robins-v7:RP2040; LCSC_PART: C2040
U2 = SparkFun-IC-Memory:W25Q32FV: W25Q32FV 32Mb (4MB) Serial Flash Memory The W25Q32FV support the standard Serial Peripheral Interface (SPI), Dual/Quad I/O SPI as well as 2-clocks instruction cycle Quad Peripheral Interface (QPI). 104MHz, SPI, 8-SOIC-EIAJ Datasheet <http://www.winbond.com/resource-files/w25q32fv%20revh%20091613.pdf> SparkFun Products SparkFun Blynk Board - ESP8266 <https://www.sparkfun.com/products/13794> (WRL-13794); LCSC_PART: C97521; PROD_ID: IC-13229; VALUE: W25Q32FV
U3 = robins-v7:HI-SIDE-SW; LCSC_PART: C55136
U4 = robins-v7:74LVC2G04: Dual Inverter; LCSC_PART: C10428
U5 U6 = robins-v7:74XX541; LCSC_PART: C113281
U7 = robins-v7:74LVC4245; LCSC_PART: C6091
U8 = SparkFun-IC-Power:V_REG_MIC5205: V_REG MIC5205 Standard 3.3V, 5V, and Adjustable 150mA LDO voltage regulator in SOT-23 layout. Micrel part MIC5205. BP (by-pass) pin is used to lower output noise with 470pF cap, may be left open. On the adjustable version BP is used to set output.; LCSC_PART: C485517; PROD_ID: VREG-00822; VALUE: 3.3V/150mA
Y1 = SparkFun-Clocks:CRYSTAL: Crystals (Generic) These are passive quartz crystals, which can be used as a clock source for a microcontroller. Crystal's are two-terminal devices. They require external "load" capacitors to generate an oscillating signal.; LCSC_PART: C9002